# Altium project PROC154E3_SCH.PrjPcb (part 14 of 60)
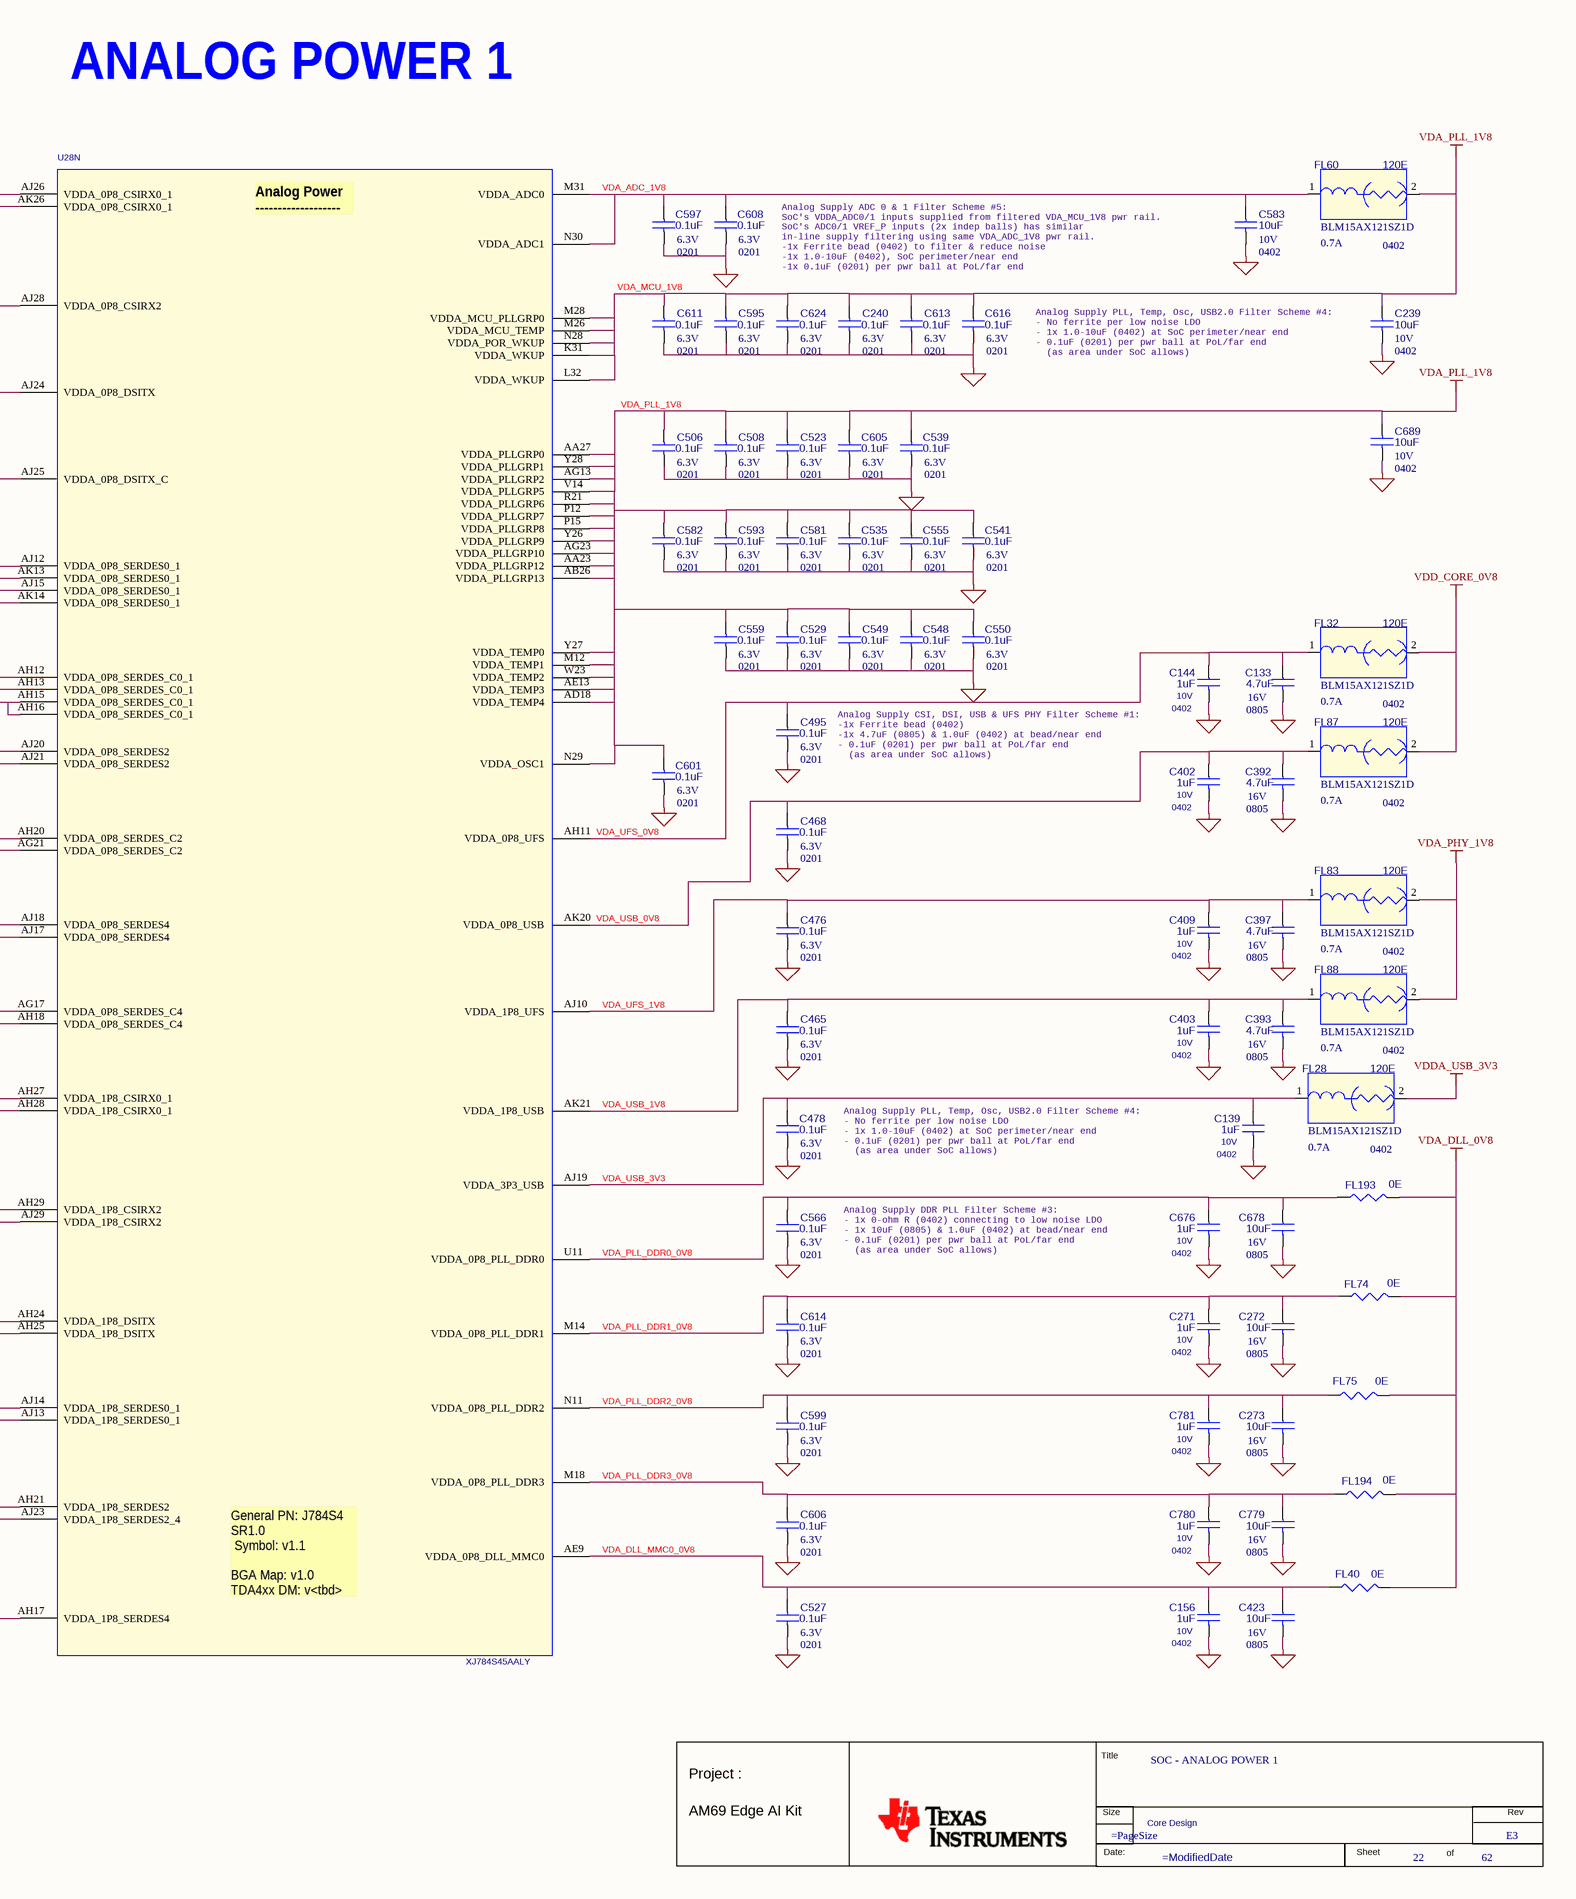
[diagram p106: 22. SOC ANALOG POWER 1.SchDoc, right]

## Sheet 22. SOC ANALOG POWER 1.SchDoc: SOC - ANALOG POWER 1 (continued)
### Library data of the parts
*#22 = MISTRAL_TITLEBLK_CSIZE_1: Issue: 1.0; Project: PROC154E2(001)_SK_AM69; Name: PROC154E2 001 SK AM69; Page Create Date: March  8, 1995; Page Size: =PageSize; Page Modify Date: =ModifiedDate; Schematic Page Count: 62; Schematic Page Number: 22
C123 = CAP_Dup1: CAP CERAMIC 4.7uF 16V 10% X7R AUTO 0805; Part Reference: C123; Part_type: CAPACITORS\CERAMIC; Mfr_part_number: GCM21BR71C475KA73K; Mfr_name: MURATA; Mistral Part No: 120018100002-R; Custom_Duty: 15%; Customs_HS_Code: 85322990; Wattage: NA; Project: TI_J7_SVB-DUT; Value: 4.7uF; PCB Footprint: CAP0805_1-5; Footprint Path: Y:\MIS_DATABASE\Library\ALTIUM_TOOL\PCB_FOOTPRINTS\Altium_Footprint_Lib.PcbLib; Library Path: Y:\MIS_DATABASE\Library\ALTIUM_TOOL\SCHEMATICS_PARTS\MS_DISCRETE_Library.schlib; MECHANICAL 3D STEP FILE: CAP0805_1-5; Chkd/date: MANIRAJA/011018; Crtd /date: MANIRAJA/011018; Datasheet: Y:\MIS_DATABASE\DATASHEETS\CAPACITORS\GCM21BR71C475KA73.PDF; Temperature: -55°C+125°C; Weight: 9.5mg; Height: 1.40MM; Library Ref: CAP; Distributor_part_number: 490-14532-1-ND; Distributor_name: DIGIKEY; Tolerance: 10%; Footprint Ref: CAP0805_1-25; Manufacturer: MURATA
C124 = CAP_Dup1: CAP CERAMIC 4.7uF 16V 10% X7R AUTO 0805; Part Reference: C124; Part_type: CAPACITORS\CERAMIC; Mfr_part_number: GCM21BR71C475KA73K; Mfr_name: MURATA; Mistral Part No: 120018100002-R; Custom_Duty: 15%; Customs_HS_Code: 85322990; Wattage: NA; Project: TI_J7_SVB-DUT; Value: 4.7uF; PCB Footprint: CAP0805_1-5; Footprint Path: Y:\MIS_DATABASE\Library\ALTIUM_TOOL\PCB_FOOTPRINTS\Altium_Footprint_Lib.PcbLib; Library Path: Y:\MIS_DATABASE\Library\ALTIUM_TOOL\SCHEMATICS_PARTS\MS_DISCRETE_Library.schlib; MECHANICAL 3D STEP FILE: CAP0805_1-5; Chkd/date: MANIRAJA/011018; Crtd /date: MANIRAJA/011018; Datasheet: Y:\MIS_DATABASE\DATASHEETS\CAPACITORS\GCM21BR71C475KA73.PDF; Temperature: -55°C+125°C; Weight: 9.5mg; Height: 1.40MM; Library Ref: CAP; Distributor_part_number: 490-14532-1-ND; Distributor_name: DIGIKEY; Tolerance: 10%; Footprint Ref: CAP0805_1-25; Manufacturer: MURATA
C125 = CAP_Dup1: CAP CERAMIC 22uF 6.3V 20% X7T AUTO 0805; Part Reference: C125; Mistral Part No: 120018100065-R; Mfr_name: MURATA; Mfr_part_number: GCM21BD70J226ME36L; Part_type: CAPACITORS\CERAMIC; Automotive Alternate_mfr_name: TDK; Automotive Alternate_mfr_part_number: CGA4J1X7T0J226M; Project: TI_J7ES_EVM_SOM; Wattage: NA; Customs_HS_Code: 85322990; Custom_Duty: 15%; Value: 22uF; PCB Footprint: CAP0805_1-25; Footprint Ref: CAP0805_1-25; Tolerance: 20%; Distributor_name: MOUSER; Distributor_part_number: 81-GCM21BD70J226ME6L; Library Ref: CAP; Height: 1.25MM; Weight: NA; Temperature: -55°C+125°C; Datasheet: Y:\MIS_DATABASE\DATASHEETS\CAPACITORS\GCM-SERIES.PDF; Crtd /date: ALVY/251018; Chkd/date: MANIRAJA/261018; MECHANICAL 3D STEP FILE: CAP0805_1-25; Library Path: Y:\MIS_DATABASE\Library\ALTIUM_TOOL\SCHEMATICS_PARTS\MS_DISCRETE_Library.schlib; Footprint Path: Y:\MIS_DATABASE\Library\ALTIUM_TOOL\PCB_FOOTPRINTS\Altium_Footprint_Lib.PcbLib; Manufacturer: MURATA
C126 = CAP_Dup1: CAP CERAMIC 22uF 6.3V 20% X7T AUTO 0805; Part Reference: C126; Part_type: CAPACITORS\CERAMIC; Mfr_part_number: GCM21BD70J226ME36L; Mfr_name: MURATA; Mistral Part No: 120018100065-R; Automotive Alternate_mfr_name: TDK; Automotive Alternate_mfr_part_number: CGA4J1X7T0J226M; Custom_Duty: 15%; Customs_HS_Code: 85322990; Wattage: NA; Project: TI_J7ES_EVM_SOM; Value: 22uF; PCB Footprint: CAP0805_1-25; Footprint Path: Y:\MIS_DATABASE\Library\ALTIUM_TOOL\PCB_FOOTPRINTS\Altium_Footprint_Lib.PcbLib; Library Path: Y:\MIS_DATABASE\Library\ALTIUM_TOOL\SCHEMATICS_PARTS\MS_DISCRETE_Library.schlib; MECHANICAL 3D STEP FILE: CAP0805_1-25; Chkd/date: MANIRAJA/261018; Crtd /date: ALVY/251018; Datasheet: Y:\MIS_DATABASE\DATASHEETS\CAPACITORS\GCM-SERIES.PDF; Temperature: -55°C+125°C; Weight: NA; Height: 1.25MM; Library Ref: CAP; Distributor_part_number: 81-GCM21BD70J226ME6L; Distributor_name: MOUSER; Tolerance: 20%; Footprint Ref: CAP0805_1-25; Manufacturer: MURATA
C127 = CAP_Dup1: CAP CERAMIC 22uF 6.3V 20% X7T AUTO 0805; Part Reference: C127; Part_type: CAPACITORS\CERAMIC; Mfr_part_number: GCM21BD70J226ME36L; Mfr_name: MURATA; Mistral Part No: 120018100065-R; Automotive Alternate_mfr_name: TDK; Automotive Alternate_mfr_part_number: CGA4J1X7T0J226M; Custom_Duty: 15%; Customs_HS_Code: 85322990; Wattage: NA; Project: TI_J7ES_EVM_SOM; Value: 22uF; PCB Footprint: CAP0805_1-25; Footprint Path: Y:\MIS_DATABASE\Library\ALTIUM_TOOL\PCB_FOOTPRINTS\Altium_Footprint_Lib.PcbLib; Library Path: Y:\MIS_DATABASE\Library\ALTIUM_TOOL\SCHEMATICS_PARTS\MS_DISCRETE_Library.schlib; MECHANICAL 3D STEP FILE: CAP0805_1-25; Chkd/date: MANIRAJA/261018; Crtd /date: ALVY/251018; Datasheet: Y:\MIS_DATABASE\DATASHEETS\CAPACITORS\GCM-SERIES.PDF; Temperature: -55°C+125°C; Weight: NA; Height: 1.25MM; Library Ref: CAP; Distributor_part_number: 81-GCM21BD70J226ME6L; Distributor_name: MOUSER; Tolerance: 20%; Footprint Ref: CAP0805_1-25; Manufacturer: MURATA
C128 = CAP_Dup1: CAP CERAMIC 22uF 6.3V 20% X7T AUTO 0805; Part Reference: C128; Automotive Alternate_mfr_part_number: CGA4J1X7T0J226M; Automotive Alternate_mfr_name: TDK; Part_type: CAPACITORS\CERAMIC; Mfr_part_number: GCM21BD70J226ME36L; Mfr_name: MURATA; Mistral Part No: 120018100065-R; Custom_Duty: 15%; Customs_HS_Code: 85322990; Wattage: NA; Project: TI_J7ES_EVM_SOM; Value: 22uF; PCB Footprint: CAP0805_1-25; Footprint Path: Y:\MIS_DATABASE\Library\ALTIUM_TOOL\PCB_FOOTPRINTS\Altium_Footprint_Lib.PcbLib; Library Path: Y:\MIS_DATABASE\Library\ALTIUM_TOOL\SCHEMATICS_PARTS\MS_DISCRETE_Library.schlib; MECHANICAL 3D STEP FILE: CAP0805_1-25; Chkd/date: MANIRAJA/261018; Crtd /date: ALVY/251018; Datasheet: Y:\MIS_DATABASE\DATASHEETS\CAPACITORS\GCM-SERIES.PDF; Temperature: -55°C+125°C; Weight: NA; Height: 1.25MM; Library Ref: CAP; Distributor_part_number: 81-GCM21BD70J226ME6L; Distributor_name: MOUSER; Tolerance: 20%; Footprint Ref: CAP0805_1-25; Manufacturer: MURATA
C129 = CAP_Dup1: CAP CERAMIC 22uF 6.3V 20% X7T AUTO 0805; Part Reference: C129; Mistral Part No: 120018100065-R; Mfr_name: MURATA; Mfr_part_number: GCM21BD70J226ME36L; Part_type: CAPACITORS\CERAMIC; Automotive Alternate_mfr_name: TDK; Automotive Alternate_mfr_part_number: CGA4J1X7T0J226M; Project: TI_J7ES_EVM_SOM; Wattage: NA; Customs_HS_Code: 85322990; Custom_Duty: 15%; Value: 22uF; PCB Footprint: CAP0805_1-25; Footprint Ref: CAP0805_1-25; Tolerance: 20%; Distributor_name: MOUSER; Distributor_part_number: 81-GCM21BD70J226ME6L; Library Ref: CAP; Height: 1.25MM; Weight: NA; Temperature: -55°C+125°C; Datasheet: Y:\MIS_DATABASE\DATASHEETS\CAPACITORS\GCM-SERIES.PDF; Crtd /date: ALVY/251018; Chkd/date: MANIRAJA/261018; MECHANICAL 3D STEP FILE: CAP0805_1-25; Library Path: Y:\MIS_DATABASE\Library\ALTIUM_TOOL\SCHEMATICS_PARTS\MS_DISCRETE_Library.schlib; Footprint Path: Y:\MIS_DATABASE\Library\ALTIUM_TOOL\PCB_FOOTPRINTS\Altium_Footprint_Lib.PcbLib; Manufacturer: MURATA
C130 = CAP_Dup1: CAP CERAMIC 22uF 6.3V 20% X7T AUTO 0805; Part Reference: C130; Part_type: CAPACITORS\CERAMIC; Mfr_part_number: GCM21BD70J226ME36L; Mfr_name: MURATA; Mistral Part No: 120018100065-R; Automotive Alternate_mfr_name: TDK; Automotive Alternate_mfr_part_number: CGA4J1X7T0J226M; Custom_Duty: 15%; Customs_HS_Code: 85322990; Wattage: NA; Project: TI_J7ES_EVM_SOM; Value: 22uF; PCB Footprint: CAP0805_1-25; Footprint Path: Y:\MIS_DATABASE\Library\ALTIUM_TOOL\PCB_FOOTPRINTS\Altium_Footprint_Lib.PcbLib; Library Path: Y:\MIS_DATABASE\Library\ALTIUM_TOOL\SCHEMATICS_PARTS\MS_DISCRETE_Library.schlib; MECHANICAL 3D STEP FILE: CAP0805_1-25; Chkd/date: MANIRAJA/261018; Crtd /date: ALVY/251018; Datasheet: Y:\MIS_DATABASE\DATASHEETS\CAPACITORS\GCM-SERIES.PDF; Temperature: -55°C+125°C; Weight: NA; Height: 1.25MM; Library Ref: CAP; Distributor_part_number: 81-GCM21BD70J226ME6L; Distributor_name: MOUSER; Tolerance: 20%; Footprint Ref: CAP0805_1-25; Manufacturer: MURATA
C133 = CAP_Dup1: CAP CERAMIC 4.7uF 16V 10% X7R AUTO 0805; Part Reference: C133; Mistral Part No: 120018100002-R; Mfr_name: MURATA; Mfr_part_number: GCM21BR71C475KA73K; Part_type: CAPACITORS\CERAMIC; Project: TI_J7_SVB-DUT; Wattage: NA; Customs_HS_Code: 85322990; Custom_Duty: 15%; Value: 4.7uF; PCB Footprint: CAP0805_1-5; Footprint Ref: CAP0805_1-25; Tolerance: 10%; Distributor_name: DIGIKEY; Distributor_part_number: 490-14532-1-ND; Library Ref: CAP; Height: 1.40MM; Weight: 9.5mg; Temperature: -55°C+125°C; Datasheet: Y:\MIS_DATABASE\DATASHEETS\CAPACITORS\GCM21BR71C475KA73.PDF; Crtd /date: MANIRAJA/011018; Chkd/date: MANIRAJA/011018; MECHANICAL 3D STEP FILE: CAP0805_1-5; Library Path: Y:\MIS_DATABASE\Library\ALTIUM_TOOL\SCHEMATICS_PARTS\MS_DISCRETE_Library.schlib; Footprint Path: Y:\MIS_DATABASE\Library\ALTIUM_TOOL\PCB_FOOTPRINTS\Altium_Footprint_Lib.PcbLib; Manufacturer: MURATA
C134 = CAP_Dup1: CAP CERAMIC 1uF 10V 10% X7S AUTO 0402; Part Reference: C134; Mistral Part No: 120018090021-R; Mfr_name: MURATA; Mfr_part_number: GCM155C71A105KE38D; Part_type: CAPACITORS\CERAMIC; Project: SMART-M_SCRIPTALK_PB; Wattage: NA; Customs_HS_Code: 85322990; Custom_Duty: 15%; Value: 1uF; PCB Footprint: CAP0402_0-75; Footprint Ref: CAP0402_0-75; Tolerance: 10%; Distributor_name: DIGIKEY; Distributor_part_number: 490-13409-1-ND; Library Ref: CAP; Height: 0.70MM; Weight: 6mg; Temperature: -55°C+125°C; Datasheet: Y:\MIS_DATABASE\DATASHEETS\CAPACITORS\MURATA-GCM-SER.PDF; Crtd /date: ALVY/100918; Chkd/date: MANIRAJA/100918; MECHANICAL 3D STEP FILE: CAP0402_0-75; Library Path: Y:\MIS_DATABASE\Library\ALTIUM_TOOL\SCHEMATICS_PARTS\MS_DISCRETE_Library.schlib; Footprint Path: Y:\MIS_DATABASE\Library\ALTIUM_TOOL\PCB_FOOTPRINTS\Altium_Footprint_Lib.PcbLib; Manufacturer: MURATA
C135 = CAP_Dup1: CAP CERAMIC 1uF 10V 10% X7S AUTO 0402; Part Reference: C135; Mistral Part No: 120018090021-R; Mfr_name: MURATA; Mfr_part_number: GCM155C71A105KE38D; Part_type: CAPACITORS\CERAMIC; Project: SMART-M_SCRIPTALK_PB; Wattage: NA; Customs_HS_Code: 85322990; Custom_Duty: 15%; Value: 1uF; PCB Footprint: CAP0402_0-75; Footprint Ref: CAP0402_0-75; Tolerance: 10%; Distributor_name: DIGIKEY; Distributor_part_number: 490-13409-1-ND; Library Ref: CAP; Height: 0.70MM; Weight: 6mg; Temperature: -55°C+125°C; Datasheet: Y:\MIS_DATABASE\DATASHEETS\CAPACITORS\MURATA-GCM-SER.PDF; Crtd /date: ALVY/100918; Chkd/date: MANIRAJA/100918; MECHANICAL 3D STEP FILE: CAP0402_0-75; Library Path: Y:\MIS_DATABASE\Library\ALTIUM_TOOL\SCHEMATICS_PARTS\MS_DISCRETE_Library.schlib; Footprint Path: Y:\MIS_DATABASE\Library\ALTIUM_TOOL\PCB_FOOTPRINTS\Altium_Footprint_Lib.PcbLib; Manufacturer: MURATA
C136 = CAP_Dup1: CAP CERAMIC 1uF 10V 10% X7S AUTO 0402; Part Reference: C136; Part_type: CAPACITORS\CERAMIC; Mfr_part_number: GCM155C71A105KE38D; Mfr_name: MURATA; Mistral Part No: 120018090021-R; Custom_Duty: 15%; Customs_HS_Code: 85322990; Wattage: NA; Project: SMART-M_SCRIPTALK_PB; Value: 1uF; PCB Footprint: CAP0402_0-75; Footprint Path: Y:\MIS_DATABASE\Library\ALTIUM_TOOL\PCB_FOOTPRINTS\Altium_Footprint_Lib.PcbLib; Library Path: Y:\MIS_DATABASE\Library\ALTIUM_TOOL\SCHEMATICS_PARTS\MS_DISCRETE_Library.schlib; MECHANICAL 3D STEP FILE: CAP0402_0-75; Chkd/date: MANIRAJA/100918; Crtd /date: ALVY/100918; Datasheet: Y:\MIS_DATABASE\DATASHEETS\CAPACITORS\MURATA-GCM-SER.PDF; Temperature: -55°C+125°C; Weight: 6mg; Height: 0.70MM; Library Ref: CAP; Distributor_part_number: 490-13409-1-ND; Distributor_name: DIGIKEY; Tolerance: 10%; Footprint Ref: CAP0402_0-75; Manufacturer: MURATA
C137 = CAP_Dup1: CAP CERAMIC 1uF 10V 10% X7S AUTO 0402; Part Reference: C137; Part_type: CAPACITORS\CERAMIC; Mfr_part_number: GCM155C71A105KE38D; Mfr_name: MURATA; Mistral Part No: 120018090021-R; Custom_Duty: 15%; Customs_HS_Code: 85322990; Wattage: NA; Project: SMART-M_SCRIPTALK_PB; Value: 1uF; PCB Footprint: CAP0402_0-75; Footprint Path: Y:\MIS_DATABASE\Library\ALTIUM_TOOL\PCB_FOOTPRINTS\Altium_Footprint_Lib.PcbLib; Library Path: Y:\MIS_DATABASE\Library\ALTIUM_TOOL\SCHEMATICS_PARTS\MS_DISCRETE_Library.schlib; MECHANICAL 3D STEP FILE: CAP0402_0-75; Chkd/date: MANIRAJA/100918; Crtd /date: ALVY/100918; Datasheet: Y:\MIS_DATABASE\DATASHEETS\CAPACITORS\MURATA-GCM-SER.PDF; Temperature: -55°C+125°C; Weight: 6mg; Height: 0.70MM; Library Ref: CAP; Distributor_part_number: 490-13409-1-ND; Distributor_name: DIGIKEY; Tolerance: 10%; Footprint Ref: CAP0402_0-75; Manufacturer: MURATA
C138 = CAP_Dup1: CAP CERAMIC 1uF 10V 10% X7S AUTO 0402; Part Reference: C138; Mistral Part No: 120018090021-R; Mfr_name: MURATA; Mfr_part_number: GCM155C71A105KE38D; Part_type: CAPACITORS\CERAMIC; Project: SMART-M_SCRIPTALK_PB; Wattage: NA; Customs_HS_Code: 85322990; Custom_Duty: 15%; Value: 1uF; PCB Footprint: CAP0402_0-75; Footprint Ref: CAP0402_0-75; Tolerance: 10%; Distributor_name: DIGIKEY; Distributor_part_number: 490-13409-1-ND; Library Ref: CAP; Height: 0.70MM; Weight: 6mg; Temperature: -55°C+125°C; Datasheet: Y:\MIS_DATABASE\DATASHEETS\CAPACITORS\MURATA-GCM-SER.PDF; Crtd /date: ALVY/100918; Chkd/date: MANIRAJA/100918; MECHANICAL 3D STEP FILE: CAP0402_0-75; Library Path: Y:\MIS_DATABASE\Library\ALTIUM_TOOL\SCHEMATICS_PARTS\MS_DISCRETE_Library.schlib; Footprint Path: Y:\MIS_DATABASE\Library\ALTIUM_TOOL\PCB_FOOTPRINTS\Altium_Footprint_Lib.PcbLib; Manufacturer: MURATA
C139 = CAP_Dup1: CAP CERAMIC 1uF 10V 10% X7S AUTO 0402; Part Reference: C139; Manufacturer: MURATA; Mistral Part No: 120018090021-R; Mfr_part_number: GCM155C71A105KE38D; Part_type: CAPACITORS\CERAMIC; Project: SMART-M_SCRIPTALK_PB; Wattage: NA; Customs_HS_Code: 85322990; Custom_Duty: 15%; Value: 1uF; Footprint Ref: CAP0402_0-75; Mfr_name: MURATA; Tolerance: 10%; Distributor_name: DIGIKEY; Distributor_part_number: 490-13409-1-ND; Library Ref: CAP; Height: 0.70MM; Weight: 6mg; Temperature: -55°C+125°C; Datasheet: Y:\MIS_DATABASE\DATASHEETS\CAPACITORS\MURATA-GCM-SER.PDF; Crtd /date: ALVY/100918; Chkd/date: MANIRAJA/100918; MECHANICAL 3D STEP FILE: CAP0402_0-75; Library Path: Y:\MIS_DATABASE\Library\ALTIUM_TOOL\SCHEMATICS_PARTS\MS_DISCRETE_Library.schlib; Footprint Path: Y:\MIS_DATABASE\Library\ALTIUM_TOOL\PCB_FOOTPRINTS\Altium_Footprint_Lib.PcbLib; PCB Footprint: CAP0402_0-75
C140 = CAP_Dup1: CAP CERAMIC 1uF 10V 10% X7S AUTO 0402; Part Reference: C140; Mistral Part No: 120018090021-R; Mfr_name: MURATA; Mfr_part_number: GCM155C71A105KE38D; Part_type: CAPACITORS\CERAMIC; Project: SMART-M_SCRIPTALK_PB; Wattage: NA; Customs_HS_Code: 85322990; Custom_Duty: 15%; Value: 1uF; PCB Footprint: CAP0402_0-75; Footprint Ref: CAP0402_0-75; Tolerance: 10%; Distributor_name: DIGIKEY; Distributor_part_number: 490-13409-1-ND; Library Ref: CAP; Height: 0.70MM; Weight: 6mg; Temperature: -55°C+125°C; Datasheet: Y:\MIS_DATABASE\DATASHEETS\CAPACITORS\MURATA-GCM-SER.PDF; Crtd /date: ALVY/100918; Chkd/date: MANIRAJA/100918; MECHANICAL 3D STEP FILE: CAP0402_0-75; Library Path: Y:\MIS_DATABASE\Library\ALTIUM_TOOL\SCHEMATICS_PARTS\MS_DISCRETE_Library.schlib; Footprint Path: Y:\MIS_DATABASE\Library\ALTIUM_TOOL\PCB_FOOTPRINTS\Altium_Footprint_Lib.PcbLib; Manufacturer: MURATA
C141 = CAP_Dup1: CAP CERAMIC 1uF 10V 10% X7S AUTO 0402; Part Reference: C141; Part_type: CAPACITORS\CERAMIC; Mfr_part_number: GCM155C71A105KE38D; Mfr_name: MURATA; Mistral Part No: 120018090021-R; Custom_Duty: 15%; Customs_HS_Code: 85322990; Wattage: NA; Project: SMART-M_SCRIPTALK_PB; Value: 1uF; PCB Footprint: CAP0402_0-75; Footprint Path: Y:\MIS_DATABASE\Library\ALTIUM_TOOL\PCB_FOOTPRINTS\Altium_Footprint_Lib.PcbLib; Library Path: Y:\MIS_DATABASE\Library\ALTIUM_TOOL\SCHEMATICS_PARTS\MS_DISCRETE_Library.schlib; MECHANICAL 3D STEP FILE: CAP0402_0-75; Chkd/date: MANIRAJA/100918; Crtd /date: ALVY/100918; Datasheet: Y:\MIS_DATABASE\DATASHEETS\CAPACITORS\MURATA-GCM-SER.PDF; Temperature: -55°C+125°C; Weight: 6mg; Height: 0.70MM; Library Ref: CAP; Distributor_part_number: 490-13409-1-ND; Distributor_name: DIGIKEY; Tolerance: 10%; Footprint Ref: CAP0402_0-75; Manufacturer: MURATA
C142 = CAP_Dup1: CAP CERAMIC 1uF 10V 10% X7S AUTO 0402; Part Reference: C142; Part_type: CAPACITORS\CERAMIC; Mfr_part_number: GCM155C71A105KE38D; Mfr_name: MURATA; Mistral Part No: 120018090021-R; Custom_Duty: 15%; Customs_HS_Code: 85322990; Wattage: NA; Project: SMART-M_SCRIPTALK_PB; Value: 1uF; PCB Footprint: CAP0402_0-75; Footprint Path: Y:\MIS_DATABASE\Library\ALTIUM_TOOL\PCB_FOOTPRINTS\Altium_Footprint_Lib.PcbLib; Library Path: Y:\MIS_DATABASE\Library\ALTIUM_TOOL\SCHEMATICS_PARTS\MS_DISCRETE_Library.schlib; MECHANICAL 3D STEP FILE: CAP0402_0-75; Chkd/date: MANIRAJA/100918; Crtd /date: ALVY/100918; Datasheet: Y:\MIS_DATABASE\DATASHEETS\CAPACITORS\MURATA-GCM-SER.PDF; Temperature: -55°C+125°C; Weight: 6mg; Height: 0.70MM; Library Ref: CAP; Distributor_part_number: 490-13409-1-ND; Distributor_name: DIGIKEY; Tolerance: 10%; Footprint Ref: CAP0402_0-75; Manufacturer: MURATA
C144 = CAP_Dup1: CAP CERAMIC 1uF 10V 10% X7S AUTO 0402; Part Reference: C144; Part_type: CAPACITORS\CERAMIC; Mfr_part_number: GCM155C71A105KE38D; Mfr_name: MURATA; Mistral Part No: 120018090021-R; Custom_Duty: 15%; Customs_HS_Code: 85322990; Wattage: NA; Project: SMART-M_SCRIPTALK_PB; Value: 1uF; PCB Footprint: CAP0402_0-75; Footprint Path: Y:\MIS_DATABASE\Library\ALTIUM_TOOL\PCB_FOOTPRINTS\Altium_Footprint_Lib.PcbLib; Library Path: Y:\MIS_DATABASE\Library\ALTIUM_TOOL\SCHEMATICS_PARTS\MS_DISCRETE_Library.schlib; MECHANICAL 3D STEP FILE: CAP0402_0-75; Chkd/date: MANIRAJA/100918; Crtd /date: ALVY/100918; Datasheet: Y:\MIS_DATABASE\DATASHEETS\CAPACITORS\MURATA-GCM-SER.PDF; Temperature: -55°C+125°C; Weight: 6mg; Height: 0.70MM; Library Ref: CAP; Distributor_part_number: 490-13409-1-ND; Distributor_name: DIGIKEY; Tolerance: 10%; Footprint Ref: CAP0402_0-75; Manufacturer: MURATA
C156 = CAP_Dup1: CAP CERAMIC 1uF 10V 10% X7S AUTO 0402; Part Reference: C156; Mistral Part No: 120018090021-R; Mfr_name: MURATA; Mfr_part_number: GCM155C71A105KE38D; Part_type: CAPACITORS\CERAMIC; Project: SMART-M_SCRIPTALK_PB; Wattage: NA; Customs_HS_Code: 85322990; Custom_Duty: 15%; Value: 1uF; PCB Footprint: CAP0402_0-75; Footprint Ref: CAP0402_0-75; Tolerance: 10%; Distributor_name: DIGIKEY; Distributor_part_number: 490-13409-1-ND; Library Ref: CAP; Height: 0.70MM; Weight: 6mg; Temperature: -55°C+125°C; Datasheet: Y:\MIS_DATABASE\DATASHEETS\CAPACITORS\MURATA-GCM-SER.PDF; Crtd /date: ALVY/100918; Chkd/date: MANIRAJA/100918; MECHANICAL 3D STEP FILE: CAP0402_0-75; Library Path: Y:\MIS_DATABASE\Library\ALTIUM_TOOL\SCHEMATICS_PARTS\MS_DISCRETE_Library.schlib; Footprint Path: Y:\MIS_DATABASE\Library\ALTIUM_TOOL\PCB_FOOTPRINTS\Altium_Footprint_Lib.PcbLib; Manufacturer: MURATA
C239 = CAP_Dup1: CAP CERAMIC 10uF 10V 20% X5R 0402; Part Reference: C239; Part_type: CAPACITORS\CERAMIC; Mfr_part_number: GRM155R61A106ME11D; Mfr_name: MURATA; Mistral Part No: 120013110019-R; Custom_Duty: 15%; Customs_HS_Code: 85322990; Wattage: NA; Project: QCS610_NANOSOM; Value: 10uF; PCB Footprint: CAP0402_0-75; Footprint Path: Y:\MIS_DATABASE\Library\ALTIUM_TOOL\PCB_FOOTPRINTS\Altium_Footprint_Lib.PcbLib; Library Path: Y:\MIS_DATABASE\Library\ALTIUM_TOOL\SCHEMATICS_PARTS\MS_DISCRETE_Library.schlib; MECHANICAL 3D STEP FILE: CAP0402_0-75; Chkd/date: MANIRAJA/300520; Crtd /date: ALVY/260520; Datasheet: Y:\MIS_DATABASE\DATASHEETS\CAPACITORS\MURATA-GXX-SER_NOV17.PDF; Temperature: -55°C+85°C; Weight: 3.1mg; Height: 0.55MM; Library Ref: CAP; Distributor_part_number: 490-GRM155R61A106ME11DTR-ND; Distributor_name: DIGIKEY; Tolerance: 20%; Footprint Ref: CAP0402_0-75; Manufacturer: MURATA
C240 = CAP_Dup1: CAP CERAMIC 0.1uF 6.3V 10% X7S AUTO 0201; Part Reference: C240; Mistral Part No: 120018100001-R; Mfr_name: MURATA; Mfr_part_number: GCM033C70J104KE02D; Part_type: CAPACITORS\CERAMIC; Project: TI_J7_SVB-DUT; Wattage: NA; Customs_HS_Code: 85322990; Custom_Duty: 15%; Value: 0.1uF; PCB Footprint: CAP0201_0-5; Footprint Ref: CAP0201_0-5; Tolerance: 10%; Distributor_name: NA; Distributor_part_number: NA; Library Ref: CAP; Height: 0.33MM; Weight: NA; Temperature: -55°C+125°C; Datasheet: Y:\MIS_DATABASE\DATASHEETS\CAPACITORS\MURATA-GCM-SER.PDF; Crtd /date: MANIRAJA/011018; Chkd/date: MANIRAJA/011018; MECHANICAL 3D STEP FILE: CAP0201_0-5; Library Path: Y:\MIS_DATABASE\Library\ALTIUM_TOOL\SCHEMATICS_PARTS\MS_DISCRETE_Library.schlib; Footprint Path: Y:\MIS_DATABASE\Library\ALTIUM_TOOL\PCB_FOOTPRINTS\Altium_Footprint_Lib.PcbLib; Manufacturer: MURATA
C271 = CAP_Dup1: CAP CERAMIC 1uF 10V 10% X7S AUTO 0402; Part Reference: C271; Mistral Part No: 120018090021-R; Mfr_name: MURATA; Mfr_part_number: GCM155C71A105KE38D; Part_type: CAPACITORS\CERAMIC; Project: SMART-M_SCRIPTALK_PB; Wattage: NA; Customs_HS_Code: 85322990; Custom_Duty: 15%; Value: 1uF; PCB Footprint: CAP0402_0-75; Footprint Ref: CAP0402_0-75; Tolerance: 10%; Distributor_name: DIGIKEY; Distributor_part_number: 490-13409-1-ND; Library Ref: CAP; Height: 0.70MM; Weight: 6mg; Temperature: -55°C+125°C; Datasheet: Y:\MIS_DATABASE\DATASHEETS\CAPACITORS\MURATA-GCM-SER.PDF; Crtd /date: ALVY/100918; Chkd/date: MANIRAJA/100918; MECHANICAL 3D STEP FILE: CAP0402_0-75; Library Path: Y:\MIS_DATABASE\Library\ALTIUM_TOOL\SCHEMATICS_PARTS\MS_DISCRETE_Library.schlib; Footprint Path: Y:\MIS_DATABASE\Library\ALTIUM_TOOL\PCB_FOOTPRINTS\Altium_Footprint_Lib.PcbLib; Manufacturer: MURATA
C272 = CAP_Dup1: CAP CERAMIC 10uF 16V 10% X5R 0805; Part Reference: C272; Direct Alternate_mfr_part_number: C2012X7S1C106K125AC; Direct Alternate_mfr_name: TDK; Automotive Alternate_mfr_part_number: CGA4J1X7S1C106K125AC; Mistral Part No: 120009030205-R; Mfr_name: MURATA; Mfr_part_number: GRM21BR61C106KE15L; Part_type: CAPACITORS\CERAMIC; Project: VOCERA; Wattage: NA; Customs_HS_Code: 85322990; Custom_Duty: 15%; Value: 10uF; PCB Footprint: CAP0805_1-5; Automotive Alternate_mfr_name: TDK; Footprint Ref: CAP0805_1-25; Tolerance: 10%; Distributor_name: DIGIKEY; Distributor_part_number: 490-3886-1-ND; Library Ref: CAP; Height: 1.35MM; Weight: 9.5mg; Temperature: -55°C+85°C; Datasheet: Y:\MIS_DATABASE\DATASHEETS\CAPACITORS\MURATA-GXX-SER_NOV17.PDF; Crtd /date: MAZHAR/150506; Chkd/date: SHREESHAIL/220506; MECHANICAL 3D STEP FILE: CAP0805_1-5; Library Path: Y:\MIS_DATABASE\Library\ALTIUM_TOOL\SCHEMATICS_PARTS\MS_DISCRETE_Library.schlib; Footprint Path: Y:\MIS_DATABASE\Library\ALTIUM_TOOL\PCB_FOOTPRINTS\Altium_Footprint_Lib.PcbLib; Manufacturer: MURATA
C273 = CAP_Dup1: CAP CERAMIC 10uF 16V 10% X5R 0805; Part Reference: C273; Direct Alternate_mfr_part_number: C2012X7S1C106K125AC; Direct Alternate_mfr_name: TDK; Automotive Alternate_mfr_part_number: CGA4J1X7S1C106K125AC; Mistral Part No: 120009030205-R; Mfr_name: MURATA; Mfr_part_number: GRM21BR61C106KE15L; Part_type: CAPACITORS\CERAMIC; Project: VOCERA; Wattage: NA; Customs_HS_Code: 85322990; Custom_Duty: 15%; Value: 10uF; PCB Footprint: CAP0805_1-5; Automotive Alternate_mfr_name: TDK; Footprint Ref: CAP0805_1-25; Tolerance: 10%; Distributor_name: DIGIKEY; Distributor_part_number: 490-3886-1-ND; Library Ref: CAP; Height: 1.35MM; Weight: 9.5mg; Temperature: -55°C+85°C; Datasheet: Y:\MIS_DATABASE\DATASHEETS\CAPACITORS\MURATA-GXX-SER_NOV17.PDF; Crtd /date: MAZHAR/150506; Chkd/date: SHREESHAIL/220506; MECHANICAL 3D STEP FILE: CAP0805_1-5; Library Path: Y:\MIS_DATABASE\Library\ALTIUM_TOOL\SCHEMATICS_PARTS\MS_DISCRETE_Library.schlib; Footprint Path: Y:\MIS_DATABASE\Library\ALTIUM_TOOL\PCB_FOOTPRINTS\Altium_Footprint_Lib.PcbLib; Manufacturer: MURATA
C389 = CAP_Dup1: CAP CERAMIC 22uF 6.3V 20% X7T AUTO 0805; Part Reference: C389; Automotive Alternate_mfr_part_number: CGA4J1X7T0J226M; Automotive Alternate_mfr_name: TDK; Part_type: CAPACITORS\CERAMIC; Mfr_part_number: GCM21BD70J226ME36L; Mfr_name: MURATA; Mistral Part No: 120018100065-R; Custom_Duty: 15%; Customs_HS_Code: 85322990; Wattage: NA; Project: TI_J7ES_EVM_SOM; Value: 22uF; PCB Footprint: CAP0805_1-25; Footprint Path: Y:\MIS_DATABASE\Library\ALTIUM_TOOL\PCB_FOOTPRINTS\Altium_Footprint_Lib.PcbLib; Library Path: Y:\MIS_DATABASE\Library\ALTIUM_TOOL\SCHEMATICS_PARTS\MS_DISCRETE_Library.schlib; MECHANICAL 3D STEP FILE: CAP0805_1-25; Chkd/date: MANIRAJA/261018; Crtd /date: ALVY/251018; Datasheet: Y:\MIS_DATABASE\DATASHEETS\CAPACITORS\GCM-SERIES.PDF; Temperature: -55°C+125°C; Weight: NA; Height: 1.25MM; Library Ref: CAP; Distributor_part_number: 81-GCM21BD70J226ME6L; Distributor_name: MOUSER; Tolerance: 20%; Footprint Ref: CAP0805_1-25; Manufacturer: MURATA
C390 = CAP_Dup1: CAP CERAMIC 22uF 6.3V 20% X7T AUTO 0805; Part Reference: C390; Automotive Alternate_mfr_part_number: CGA4J1X7T0J226M; Automotive Alternate_mfr_name: TDK; Mistral Part No: 120018100065-R; Mfr_name: MURATA; Mfr_part_number: GCM21BD70J226ME36L; Part_type: CAPACITORS\CERAMIC; Project: TI_J7ES_EVM_SOM; Wattage: NA; Customs_HS_Code: 85322990; Custom_Duty: 15%; Value: 22uF; PCB Footprint: CAP0805_1-25; Footprint Ref: CAP0805_1-25; Tolerance: 20%; Distributor_name: MOUSER; Distributor_part_number: 81-GCM21BD70J226ME6L; Library Ref: CAP; Height: 1.25MM; Weight: NA; Temperature: -55°C+125°C; Datasheet: Y:\MIS_DATABASE\DATASHEETS\CAPACITORS\GCM-SERIES.PDF; Crtd /date: ALVY/251018; Chkd/date: MANIRAJA/261018; MECHANICAL 3D STEP FILE: CAP0805_1-25; Library Path: Y:\MIS_DATABASE\Library\ALTIUM_TOOL\SCHEMATICS_PARTS\MS_DISCRETE_Library.schlib; Footprint Path: Y:\MIS_DATABASE\Library\ALTIUM_TOOL\PCB_FOOTPRINTS\Altium_Footprint_Lib.PcbLib; Manufacturer: MURATA
C391 = CAP_Dup1: CAP CERAMIC 22uF 6.3V 20% X7T AUTO 0805; Part Reference: C391; Part_type: CAPACITORS\CERAMIC; Mfr_part_number: GCM21BD70J226ME36L; Mfr_name: MURATA; Mistral Part No: 120018100065-R; Automotive Alternate_mfr_name: TDK; Automotive Alternate_mfr_part_number: CGA4J1X7T0J226M; Custom_Duty: 15%; Customs_HS_Code: 85322990; Wattage: NA; Project: TI_J7ES_EVM_SOM; Value: 22uF; PCB Footprint: CAP0805_1-25; Footprint Path: Y:\MIS_DATABASE\Library\ALTIUM_TOOL\PCB_FOOTPRINTS\Altium_Footprint_Lib.PcbLib; Library Path: Y:\MIS_DATABASE\Library\ALTIUM_TOOL\SCHEMATICS_PARTS\MS_DISCRETE_Library.schlib; MECHANICAL 3D STEP FILE: CAP0805_1-25; Chkd/date: MANIRAJA/261018; Crtd /date: ALVY/251018; Datasheet: Y:\MIS_DATABASE\DATASHEETS\CAPACITORS\GCM-SERIES.PDF; Temperature: -55°C+125°C; Weight: NA; Height: 1.25MM; Library Ref: CAP; Distributor_part_number: 81-GCM21BD70J226ME6L; Distributor_name: MOUSER; Tolerance: 20%; Footprint Ref: CAP0805_1-25; Manufacturer: MURATA
C392 = CAP_Dup1: CAP CERAMIC 4.7uF 16V 10% X7R AUTO 0805; Part Reference: C392; Mistral Part No: 120018100002-R; Mfr_name: MURATA; Mfr_part_number: GCM21BR71C475KA73K; Part_type: CAPACITORS\CERAMIC; Project: TI_J7_SVB-DUT; Wattage: NA; Customs_HS_Code: 85322990; Custom_Duty: 15%; Value: 4.7uF; PCB Footprint: CAP0805_1-5; Footprint Ref: CAP0805_1-25; Tolerance: 10%; Distributor_name: DIGIKEY; Distributor_part_number: 490-14532-1-ND; Library Ref: CAP; Height: 1.40MM; Weight: 9.5mg; Temperature: -55°C+125°C; Datasheet: Y:\MIS_DATABASE\DATASHEETS\CAPACITORS\GCM21BR71C475KA73.PDF; Crtd /date: MANIRAJA/011018; Chkd/date: MANIRAJA/011018; MECHANICAL 3D STEP FILE: CAP0805_1-5; Library Path: Y:\MIS_DATABASE\Library\ALTIUM_TOOL\SCHEMATICS_PARTS\MS_DISCRETE_Library.schlib; Footprint Path: Y:\MIS_DATABASE\Library\ALTIUM_TOOL\PCB_FOOTPRINTS\Altium_Footprint_Lib.PcbLib; Manufacturer: MURATA
C393 = CAP_Dup1: CAP CERAMIC 4.7uF 16V 10% X7R AUTO 0805; Part Reference: C393; Mistral Part No: 120018100002-R; Mfr_name: MURATA; Mfr_part_number: GCM21BR71C475KA73K; Part_type: CAPACITORS\CERAMIC; Project: TI_J7_SVB-DUT; Wattage: NA; Customs_HS_Code: 85322990; Custom_Duty: 15%; Value: 4.7uF; PCB Footprint: CAP0805_1-5; Footprint Ref: CAP0805_1-25; Tolerance: 10%; Distributor_name: DIGIKEY; Distributor_part_number: 490-14532-1-ND; Library Ref: CAP; Height: 1.40MM; Weight: 9.5mg; Temperature: -55°C+125°C; Datasheet: Y:\MIS_DATABASE\DATASHEETS\CAPACITORS\GCM21BR71C475KA73.PDF; Crtd /date: MANIRAJA/011018; Chkd/date: MANIRAJA/011018; MECHANICAL 3D STEP FILE: CAP0805_1-5; Library Path: Y:\MIS_DATABASE\Library\ALTIUM_TOOL\SCHEMATICS_PARTS\MS_DISCRETE_Library.schlib; Footprint Path: Y:\MIS_DATABASE\Library\ALTIUM_TOOL\PCB_FOOTPRINTS\Altium_Footprint_Lib.PcbLib; Manufacturer: MURATA
C394 = CAP_Dup1: CAP CERAMIC 4.7uF 16V 10% X7R AUTO 0805; Part Reference: C394; Manufacturer: MURATA; Part_type: CAPACITORS\CERAMIC; Mfr_part_number: GCM21BR71C475KA73K; Mistral Part No: 120018100002-R; Custom_Duty: 15%; Customs_HS_Code: 85322990; Wattage: NA; Project: TI_J7_SVB-DUT; Value: 4.7uF; PCB Footprint: CAP0805_1-5; Footprint Path: Y:\MIS_DATABASE\Library\ALTIUM_TOOL\PCB_FOOTPRINTS\Altium_Footprint_Lib.PcbLib; Library Path: Y:\MIS_DATABASE\Library\ALTIUM_TOOL\SCHEMATICS_PARTS\MS_DISCRETE_Library.schlib; MECHANICAL 3D STEP FILE: CAP0805_1-5; Chkd/date: MANIRAJA/011018; Crtd /date: MANIRAJA/011018; Datasheet: Y:\MIS_DATABASE\DATASHEETS\CAPACITORS\GCM21BR71C475KA73.PDF; Temperature: -55°C+125°C; Weight: 9.5mg; Height: 1.40MM; Library Ref: CAP; Distributor_part_number: 490-14532-1-ND; Distributor_name: DIGIKEY; Tolerance: 10%; Mfr_name: MURATA; Footprint Ref: CAP0805_1-25
C395 = CAP_Dup1: CAP CERAMIC 4.7uF 16V 10% X7R AUTO 0805; Part Reference: C395; Mistral Part No: 120018100002-R; Mfr_name: MURATA; Mfr_part_number: GCM21BR71C475KA73K; Part_type: CAPACITORS\CERAMIC; Project: TI_J7_SVB-DUT; Wattage: NA; Customs_HS_Code: 85322990; Custom_Duty: 15%; Value: 4.7uF; PCB Footprint: CAP0805_1-5; Footprint Ref: CAP0805_1-25; Tolerance: 10%; Distributor_name: DIGIKEY; Distributor_part_number: 490-14532-1-ND; Library Ref: CAP; Height: 1.40MM; Weight: 9.5mg; Temperature: -55°C+125°C; Datasheet: Y:\MIS_DATABASE\DATASHEETS\CAPACITORS\GCM21BR71C475KA73.PDF; Crtd /date: MANIRAJA/011018; Chkd/date: MANIRAJA/011018; MECHANICAL 3D STEP FILE: CAP0805_1-5; Library Path: Y:\MIS_DATABASE\Library\ALTIUM_TOOL\SCHEMATICS_PARTS\MS_DISCRETE_Library.schlib; Footprint Path: Y:\MIS_DATABASE\Library\ALTIUM_TOOL\PCB_FOOTPRINTS\Altium_Footprint_Lib.PcbLib; Manufacturer: MURATA
C396 = CAP_Dup1: CAP CERAMIC 4.7uF 16V 10% X7R AUTO 0805; Part Reference: C396; Mistral Part No: 120018100002-R; Mfr_name: MURATA; Mfr_part_number: GCM21BR71C475KA73K; Part_type: CAPACITORS\CERAMIC; Project: TI_J7_SVB-DUT; Wattage: NA; Customs_HS_Code: 85322990; Custom_Duty: 15%; Value: 4.7uF; PCB Footprint: CAP0805_1-5; Footprint Ref: CAP0805_1-25; Tolerance: 10%; Distributor_name: DIGIKEY; Distributor_part_number: 490-14532-1-ND; Library Ref: CAP; Height: 1.40MM; Weight: 9.5mg; Temperature: -55°C+125°C; Datasheet: Y:\MIS_DATABASE\DATASHEETS\CAPACITORS\GCM21BR71C475KA73.PDF; Crtd /date: MANIRAJA/011018; Chkd/date: MANIRAJA/011018; MECHANICAL 3D STEP FILE: CAP0805_1-5; Library Path: Y:\MIS_DATABASE\Library\ALTIUM_TOOL\SCHEMATICS_PARTS\MS_DISCRETE_Library.schlib; Footprint Path: Y:\MIS_DATABASE\Library\ALTIUM_TOOL\PCB_FOOTPRINTS\Altium_Footprint_Lib.PcbLib; Manufacturer: MURATA
C397 = CAP_Dup1: CAP CERAMIC 4.7uF 16V 10% X7R AUTO 0805; Part Reference: C397; Mistral Part No: 120018100002-R; Mfr_name: MURATA; Mfr_part_number: GCM21BR71C475KA73K; Part_type: CAPACITORS\CERAMIC; Project: TI_J7_SVB-DUT; Wattage: NA; Customs_HS_Code: 85322990; Custom_Duty: 15%; Value: 4.7uF; PCB Footprint: CAP0805_1-5; Footprint Ref: CAP0805_1-25; Tolerance: 10%; Distributor_name: DIGIKEY; Distributor_part_number: 490-14532-1-ND; Library Ref: CAP; Height: 1.40MM; Weight: 9.5mg; Temperature: -55°C+125°C; Datasheet: Y:\MIS_DATABASE\DATASHEETS\CAPACITORS\GCM21BR71C475KA73.PDF; Crtd /date: MANIRAJA/011018; Chkd/date: MANIRAJA/011018; MECHANICAL 3D STEP FILE: CAP0805_1-5; Library Path: Y:\MIS_DATABASE\Library\ALTIUM_TOOL\SCHEMATICS_PARTS\MS_DISCRETE_Library.schlib; Footprint Path: Y:\MIS_DATABASE\Library\ALTIUM_TOOL\PCB_FOOTPRINTS\Altium_Footprint_Lib.PcbLib; Manufacturer: MURATA
C399 = CAP_Dup1: CAP CERAMIC 1uF 10V 10% X7S AUTO 0402; Part Reference: C399; Mistral Part No: 120018090021-R; Mfr_name: MURATA; Mfr_part_number: GCM155C71A105KE38D; Part_type: CAPACITORS\CERAMIC; Project: SMART-M_SCRIPTALK_PB; Wattage: NA; Customs_HS_Code: 85322990; Custom_Duty: 15%; Value: 1uF; PCB Footprint: CAP0402_0-75; Footprint Ref: CAP0402_0-75; Tolerance: 10%; Distributor_name: DIGIKEY; Distributor_part_number: 490-13409-1-ND; Library Ref: CAP; Height: 0.70MM; Weight: 6mg; Temperature: -55°C+125°C; Datasheet: Y:\MIS_DATABASE\DATASHEETS\CAPACITORS\MURATA-GCM-SER.PDF; Crtd /date: ALVY/100918; Chkd/date: MANIRAJA/100918; MECHANICAL 3D STEP FILE: CAP0402_0-75; Library Path: Y:\MIS_DATABASE\Library\ALTIUM_TOOL\SCHEMATICS_PARTS\MS_DISCRETE_Library.schlib; Footprint Path: Y:\MIS_DATABASE\Library\ALTIUM_TOOL\PCB_FOOTPRINTS\Altium_Footprint_Lib.PcbLib; Manufacturer: MURATA
C400 = CAP_Dup1: CAP CERAMIC 1uF 10V 10% X7S AUTO 0402; Part Reference: C400; Part_type: CAPACITORS\CERAMIC; Mfr_part_number: GCM155C71A105KE38D; Mfr_name: MURATA; Mistral Part No: 120018090021-R; Custom_Duty: 15%; Customs_HS_Code: 85322990; Wattage: NA; Project: SMART-M_SCRIPTALK_PB; Value: 1uF; PCB Footprint: CAP0402_0-75; Footprint Path: Y:\MIS_DATABASE\Library\ALTIUM_TOOL\PCB_FOOTPRINTS\Altium_Footprint_Lib.PcbLib; Library Path: Y:\MIS_DATABASE\Library\ALTIUM_TOOL\SCHEMATICS_PARTS\MS_DISCRETE_Library.schlib; MECHANICAL 3D STEP FILE: CAP0402_0-75; Chkd/date: MANIRAJA/100918; Crtd /date: ALVY/100918; Datasheet: Y:\MIS_DATABASE\DATASHEETS\CAPACITORS\MURATA-GCM-SER.PDF; Temperature: -55°C+125°C; Weight: 6mg; Height: 0.70MM; Library Ref: CAP; Distributor_part_number: 490-13409-1-ND; Distributor_name: DIGIKEY; Tolerance: 10%; Footprint Ref: CAP0402_0-75; Manufacturer: MURATA
C401 = CAP_Dup1: CAP CERAMIC 1uF 10V 10% X7S AUTO 0402; Part Reference: C401; Mistral Part No: 120018090021-R; Mfr_name: MURATA; Mfr_part_number: GCM155C71A105KE38D; Part_type: CAPACITORS\CERAMIC; Project: SMART-M_SCRIPTALK_PB; Wattage: NA; Customs_HS_Code: 85322990; Custom_Duty: 15%; Value: 1uF; PCB Footprint: CAP0402_0-75; Footprint Ref: CAP0402_0-75; Tolerance: 10%; Distributor_name: DIGIKEY; Distributor_part_number: 490-13409-1-ND; Library Ref: CAP; Height: 0.70MM; Weight: 6mg; Temperature: -55°C+125°C; Datasheet: Y:\MIS_DATABASE\DATASHEETS\CAPACITORS\MURATA-GCM-SER.PDF; Crtd /date: ALVY/100918; Chkd/date: MANIRAJA/100918; MECHANICAL 3D STEP FILE: CAP0402_0-75; Library Path: Y:\MIS_DATABASE\Library\ALTIUM_TOOL\SCHEMATICS_PARTS\MS_DISCRETE_Library.schlib; Footprint Path: Y:\MIS_DATABASE\Library\ALTIUM_TOOL\PCB_FOOTPRINTS\Altium_Footprint_Lib.PcbLib; Manufacturer: MURATA
C402 = CAP_Dup1: CAP CERAMIC 1uF 10V 10% X7S AUTO 0402; Part Reference: C402; Part_type: CAPACITORS\CERAMIC; Mfr_part_number: GCM155C71A105KE38D; Mfr_name: MURATA; Mistral Part No: 120018090021-R; Custom_Duty: 15%; Customs_HS_Code: 85322990; Wattage: NA; Project: SMART-M_SCRIPTALK_PB; Value: 1uF; PCB Footprint: CAP0402_0-75; Footprint Path: Y:\MIS_DATABASE\Library\ALTIUM_TOOL\PCB_FOOTPRINTS\Altium_Footprint_Lib.PcbLib; Library Path: Y:\MIS_DATABASE\Library\ALTIUM_TOOL\SCHEMATICS_PARTS\MS_DISCRETE_Library.schlib; MECHANICAL 3D STEP FILE: CAP0402_0-75; Chkd/date: MANIRAJA/100918; Crtd /date: ALVY/100918; Datasheet: Y:\MIS_DATABASE\DATASHEETS\CAPACITORS\MURATA-GCM-SER.PDF; Temperature: -55°C+125°C; Weight: 6mg; Height: 0.70MM; Library Ref: CAP; Distributor_part_number: 490-13409-1-ND; Distributor_name: DIGIKEY; Tolerance: 10%; Footprint Ref: CAP0402_0-75; Manufacturer: MURATA
C403 = CAP_Dup1: CAP CERAMIC 1uF 10V 10% X7S AUTO 0402; Part Reference: C403; Part_type: CAPACITORS\CERAMIC; Mfr_part_number: GCM155C71A105KE38D; Mfr_name: MURATA; Mistral Part No: 120018090021-R; Custom_Duty: 15%; Customs_HS_Code: 85322990; Wattage: NA; Project: SMART-M_SCRIPTALK_PB; Value: 1uF; PCB Footprint: CAP0402_0-75; Footprint Path: Y:\MIS_DATABASE\Library\ALTIUM_TOOL\PCB_FOOTPRINTS\Altium_Footprint_Lib.PcbLib; Library Path: Y:\MIS_DATABASE\Library\ALTIUM_TOOL\SCHEMATICS_PARTS\MS_DISCRETE_Library.schlib; MECHANICAL 3D STEP FILE: CAP0402_0-75; Chkd/date: MANIRAJA/100918; Crtd /date: ALVY/100918; Datasheet: Y:\MIS_DATABASE\DATASHEETS\CAPACITORS\MURATA-GCM-SER.PDF; Temperature: -55°C+125°C; Weight: 6mg; Height: 0.70MM; Library Ref: CAP; Distributor_part_number: 490-13409-1-ND; Distributor_name: DIGIKEY; Tolerance: 10%; Footprint Ref: CAP0402_0-75; Manufacturer: MURATA
C404 = CAP_Dup1: CAP CERAMIC 1uF 10V 10% X7S AUTO 0402; Part Reference: C404; Manufacturer: MURATA; Part_type: CAPACITORS\CERAMIC; Mfr_part_number: GCM155C71A105KE38D; Mistral Part No: 120018090021-R; Custom_Duty: 15%; Customs_HS_Code: 85322990; Wattage: NA; Project: SMART-M_SCRIPTALK_PB; Value: 1uF; PCB Footprint: CAP0402_0-75; Footprint Path: Y:\MIS_DATABASE\Library\ALTIUM_TOOL\PCB_FOOTPRINTS\Altium_Footprint_Lib.PcbLib; Library Path: Y:\MIS_DATABASE\Library\ALTIUM_TOOL\SCHEMATICS_PARTS\MS_DISCRETE_Library.schlib; MECHANICAL 3D STEP FILE: CAP0402_0-75; Chkd/date: MANIRAJA/100918; Crtd /date: ALVY/100918; Datasheet: Y:\MIS_DATABASE\DATASHEETS\CAPACITORS\MURATA-GCM-SER.PDF; Temperature: -55°C+125°C; Weight: 6mg; Height: 0.70MM; Library Ref: CAP; Distributor_part_number: 490-13409-1-ND; Distributor_name: DIGIKEY; Tolerance: 10%; Mfr_name: MURATA; Footprint Ref: CAP0402_0-75
C405 = CAP_Dup1: CAP CERAMIC 1uF 10V 10% X7S AUTO 0402; Part Reference: C405; Part_type: CAPACITORS\CERAMIC; Mfr_part_number: GCM155C71A105KE38D; Mfr_name: MURATA; Mistral Part No: 120018090021-R; Custom_Duty: 15%; Customs_HS_Code: 85322990; Wattage: NA; Project: SMART-M_SCRIPTALK_PB; Value: 1uF; PCB Footprint: CAP0402_0-75; Footprint Path: Y:\MIS_DATABASE\Library\ALTIUM_TOOL\PCB_FOOTPRINTS\Altium_Footprint_Lib.PcbLib; Library Path: Y:\MIS_DATABASE\Library\ALTIUM_TOOL\SCHEMATICS_PARTS\MS_DISCRETE_Library.schlib; MECHANICAL 3D STEP FILE: CAP0402_0-75; Chkd/date: MANIRAJA/100918; Crtd /date: ALVY/100918; Datasheet: Y:\MIS_DATABASE\DATASHEETS\CAPACITORS\MURATA-GCM-SER.PDF; Temperature: -55°C+125°C; Weight: 6mg; Height: 0.70MM; Library Ref: CAP; Distributor_part_number: 490-13409-1-ND; Distributor_name: DIGIKEY; Tolerance: 10%; Footprint Ref: CAP0402_0-75; Manufacturer: MURATA
C406 = CAP_Dup1: CAP CERAMIC 1uF 10V 10% X7S AUTO 0402; Part Reference: C406; Part_type: CAPACITORS\CERAMIC; Mfr_part_number: GCM155C71A105KE38D; Mfr_name: MURATA; Mistral Part No: 120018090021-R; Custom_Duty: 15%; Customs_HS_Code: 85322990; Wattage: NA; Project: SMART-M_SCRIPTALK_PB; Value: 1uF; PCB Footprint: CAP0402_0-75; Footprint Path: Y:\MIS_DATABASE\Library\ALTIUM_TOOL\PCB_FOOTPRINTS\Altium_Footprint_Lib.PcbLib; Library Path: Y:\MIS_DATABASE\Library\ALTIUM_TOOL\SCHEMATICS_PARTS\MS_DISCRETE_Library.schlib; MECHANICAL 3D STEP FILE: CAP0402_0-75; Chkd/date: MANIRAJA/100918; Crtd /date: ALVY/100918; Datasheet: Y:\MIS_DATABASE\DATASHEETS\CAPACITORS\MURATA-GCM-SER.PDF; Temperature: -55°C+125°C; Weight: 6mg; Height: 0.70MM; Library Ref: CAP; Distributor_part_number: 490-13409-1-ND; Distributor_name: DIGIKEY; Tolerance: 10%; Footprint Ref: CAP0402_0-75; Manufacturer: MURATA
C409 = CAP_Dup1: CAP CERAMIC 1uF 10V 10% X7S AUTO 0402; Part Reference: C409; Part_type: CAPACITORS\CERAMIC; Mfr_part_number: GCM155C71A105KE38D; Mfr_name: MURATA; Mistral Part No: 120018090021-R; Custom_Duty: 15%; Customs_HS_Code: 85322990; Wattage: NA; Project: SMART-M_SCRIPTALK_PB; Value: 1uF; PCB Footprint: CAP0402_0-75; Footprint Path: Y:\MIS_DATABASE\Library\ALTIUM_TOOL\PCB_FOOTPRINTS\Altium_Footprint_Lib.PcbLib; Library Path: Y:\MIS_DATABASE\Library\ALTIUM_TOOL\SCHEMATICS_PARTS\MS_DISCRETE_Library.schlib; MECHANICAL 3D STEP FILE: CAP0402_0-75; Chkd/date: MANIRAJA/100918; Crtd /date: ALVY/100918; Datasheet: Y:\MIS_DATABASE\DATASHEETS\CAPACITORS\MURATA-GCM-SER.PDF; Temperature: -55°C+125°C; Weight: 6mg; Height: 0.70MM; Library Ref: CAP; Distributor_part_number: 490-13409-1-ND; Distributor_name: DIGIKEY; Tolerance: 10%; Footprint Ref: CAP0402_0-75; Manufacturer: MURATA
C423 = CAP_Dup1: CAP CERAMIC 10uF 16V 10% X5R 0805; Part Reference: C423; Direct Alternate_mfr_part_number: C2012X7S1C106K125AC; Direct Alternate_mfr_name: TDK; Automotive Alternate_mfr_part_number: CGA4J1X7S1C106K125AC; Mistral Part No: 120009030205-R; Mfr_name: MURATA; Mfr_part_number: GRM21BR61C106KE15L; Part_type: CAPACITORS\CERAMIC; Project: VOCERA; Wattage: NA; Customs_HS_Code: 85322990; Custom_Duty: 15%; Value: 10uF; PCB Footprint: CAP0805_1-5; Automotive Alternate_mfr_name: TDK; Footprint Ref: CAP0805_1-25; Tolerance: 10%; Distributor_name: DIGIKEY; Distributor_part_number: 490-3886-1-ND; Library Ref: CAP; Height: 1.35MM; Weight: 9.5mg; Temperature: -55°C+85°C; Datasheet: Y:\MIS_DATABASE\DATASHEETS\CAPACITORS\MURATA-GXX-SER_NOV17.PDF; Crtd /date: MAZHAR/150506; Chkd/date: SHREESHAIL/220506; MECHANICAL 3D STEP FILE: CAP0805_1-5; Library Path: Y:\MIS_DATABASE\Library\ALTIUM_TOOL\SCHEMATICS_PARTS\MS_DISCRETE_Library.schlib; Footprint Path: Y:\MIS_DATABASE\Library\ALTIUM_TOOL\PCB_FOOTPRINTS\Altium_Footprint_Lib.PcbLib; Manufacturer: MURATA
C464 = CAP_Dup1: CAP CERAMIC 0.1uF 6.3V 10% X7S AUTO 0201; Part Reference: C464; Manufacturer: MURATA; Part_type: CAPACITORS\CERAMIC; Mfr_part_number: GCM033C70J104KE02D; Mistral Part No: 120018100001-R; Custom_Duty: 15%; Customs_HS_Code: 85322990; Wattage: NA; Project: TI_J7_SVB-DUT; Value: 0.1uF; Footprint Path: Y:\MIS_DATABASE\Library\ALTIUM_TOOL\PCB_FOOTPRINTS\Altium_Footprint_Lib.PcbLib; Library Path: Y:\MIS_DATABASE\Library\ALTIUM_TOOL\SCHEMATICS_PARTS\MS_DISCRETE_Library.schlib; MECHANICAL 3D STEP FILE: CAP0201_0-5; Chkd/date: MANIRAJA/011018; Crtd /date: MANIRAJA/011018; Datasheet: Y:\MIS_DATABASE\DATASHEETS\CAPACITORS\MURATA-GCM-SER.PDF; Temperature: -55°C+125°C; Weight: NA; Height: 0.33MM; Library Ref: CAP; Distributor_part_number: NA; Distributor_name: NA; Tolerance: 10%; Mfr_name: MURATA; Footprint Ref: CAP0201_0-5; PCB Footprint: CAP0201_0-5
C465 = CAP_Dup1: CAP CERAMIC 0.1uF 6.3V 10% X7S AUTO 0201; Part Reference: C465; Mistral Part No: 120018100001-R; Mfr_name: MURATA; Mfr_part_number: GCM033C70J104KE02D; Part_type: CAPACITORS\CERAMIC; Project: TI_J7_SVB-DUT; Wattage: NA; Customs_HS_Code: 85322990; Custom_Duty: 15%; Value: 0.1uF; PCB Footprint: CAP0201_0-5; Footprint Ref: CAP0201_0-5; Tolerance: 10%; Distributor_name: NA; Distributor_part_number: NA; Library Ref: CAP; Height: 0.33MM; Weight: NA; Temperature: -55°C+125°C; Datasheet: Y:\MIS_DATABASE\DATASHEETS\CAPACITORS\MURATA-GCM-SER.PDF; Crtd /date: MANIRAJA/011018; Chkd/date: MANIRAJA/011018; MECHANICAL 3D STEP FILE: CAP0201_0-5; Library Path: Y:\MIS_DATABASE\Library\ALTIUM_TOOL\SCHEMATICS_PARTS\MS_DISCRETE_Library.schlib; Footprint Path: Y:\MIS_DATABASE\Library\ALTIUM_TOOL\PCB_FOOTPRINTS\Altium_Footprint_Lib.PcbLib; Manufacturer: MURATA
C466 = CAP_Dup1: CAP CERAMIC 0.1uF 6.3V 10% X7S AUTO 0201; Part Reference: C466; Manufacturer: MURATA; Part_type: CAPACITORS\CERAMIC; Mfr_part_number: GCM033C70J104KE02D; Mistral Part No: 120018100001-R; Custom_Duty: 15%; Customs_HS_Code: 85322990; Wattage: NA; Project: TI_J7_SVB-DUT; Value: 0.1uF; Footprint Path: Y:\MIS_DATABASE\Library\ALTIUM_TOOL\PCB_FOOTPRINTS\Altium_Footprint_Lib.PcbLib; Library Path: Y:\MIS_DATABASE\Library\ALTIUM_TOOL\SCHEMATICS_PARTS\MS_DISCRETE_Library.schlib; MECHANICAL 3D STEP FILE: CAP0201_0-5; Chkd/date: MANIRAJA/011018; Crtd /date: MANIRAJA/011018; Datasheet: Y:\MIS_DATABASE\DATASHEETS\CAPACITORS\MURATA-GCM-SER.PDF; Temperature: -55°C+125°C; Weight: NA; Height: 0.33MM; Library Ref: CAP; Distributor_part_number: NA; Distributor_name: NA; Tolerance: 10%; Mfr_name: MURATA; Footprint Ref: CAP0201_0-5; PCB Footprint: CAP0201_0-5
C468 = CAP_Dup1: CAP CERAMIC 0.1uF 6.3V 10% X7S AUTO 0201; Part Reference: C468; Mistral Part No: 120018100001-R; Mfr_name: MURATA; Mfr_part_number: GCM033C70J104KE02D; Part_type: CAPACITORS\CERAMIC; Project: TI_J7_SVB-DUT; Wattage: NA; Customs_HS_Code: 85322990; Custom_Duty: 15%; Value: 0.1uF; PCB Footprint: CAP0201_0-5; Footprint Ref: CAP0201_0-5; Tolerance: 10%; Distributor_name: NA; Distributor_part_number: NA; Library Ref: CAP; Height: 0.33MM; Weight: NA; Temperature: -55°C+125°C; Datasheet: Y:\MIS_DATABASE\DATASHEETS\CAPACITORS\MURATA-GCM-SER.PDF; Crtd /date: MANIRAJA/011018; Chkd/date: MANIRAJA/011018; MECHANICAL 3D STEP FILE: CAP0201_0-5; Library Path: Y:\MIS_DATABASE\Library\ALTIUM_TOOL\SCHEMATICS_PARTS\MS_DISCRETE_Library.schlib; Footprint Path: Y:\MIS_DATABASE\Library\ALTIUM_TOOL\PCB_FOOTPRINTS\Altium_Footprint_Lib.PcbLib; Manufacturer: MURATA
C469 = CAP_Dup1: CAP CERAMIC 0.1uF 6.3V 10% X7S AUTO 0201; Part Reference: C469; Mistral Part No: 120018100001-R; Mfr_name: MURATA; Mfr_part_number: GCM033C70J104KE02D; Part_type: CAPACITORS\CERAMIC; Project: TI_J7_SVB-DUT; Wattage: NA; Customs_HS_Code: 85322990; Custom_Duty: 15%; Value: 0.1uF; PCB Footprint: CAP0201_0-5; Footprint Ref: CAP0201_0-5; Tolerance: 10%; Distributor_name: NA; Distributor_part_number: NA; Library Ref: CAP; Height: 0.33MM; Weight: NA; Temperature: -55°C+125°C; Datasheet: Y:\MIS_DATABASE\DATASHEETS\CAPACITORS\MURATA-GCM-SER.PDF; Crtd /date: MANIRAJA/011018; Chkd/date: MANIRAJA/011018; MECHANICAL 3D STEP FILE: CAP0201_0-5; Library Path: Y:\MIS_DATABASE\Library\ALTIUM_TOOL\SCHEMATICS_PARTS\MS_DISCRETE_Library.schlib; Footprint Path: Y:\MIS_DATABASE\Library\ALTIUM_TOOL\PCB_FOOTPRINTS\Altium_Footprint_Lib.PcbLib; Manufacturer: MURATA
C470 = CAP_Dup1: CAP CERAMIC 0.1uF 6.3V 10% X7S AUTO 0201; Part Reference: C470; Mistral Part No: 120018100001-R; Mfr_name: MURATA; Mfr_part_number: GCM033C70J104KE02D; Part_type: CAPACITORS\CERAMIC; Project: TI_J7_SVB-DUT; Wattage: NA; Customs_HS_Code: 85322990; Custom_Duty: 15%; Value: 0.1uF; PCB Footprint: CAP0201_0-5; Footprint Ref: CAP0201_0-5; Tolerance: 10%; Distributor_name: NA; Distributor_part_number: NA; Library Ref: CAP; Height: 0.33MM; Weight: NA; Temperature: -55°C+125°C; Datasheet: Y:\MIS_DATABASE\DATASHEETS\CAPACITORS\MURATA-GCM-SER.PDF; Crtd /date: MANIRAJA/011018; Chkd/date: MANIRAJA/011018; MECHANICAL 3D STEP FILE: CAP0201_0-5; Library Path: Y:\MIS_DATABASE\Library\ALTIUM_TOOL\SCHEMATICS_PARTS\MS_DISCRETE_Library.schlib; Footprint Path: Y:\MIS_DATABASE\Library\ALTIUM_TOOL\PCB_FOOTPRINTS\Altium_Footprint_Lib.PcbLib; Manufacturer: MURATA
C471 = CAP_Dup1: CAP CERAMIC 0.1uF 6.3V 10% X7S AUTO 0201; Part Reference: C471; Mistral Part No: 120018100001-R; Mfr_name: MURATA; Mfr_part_number: GCM033C70J104KE02D; Part_type: CAPACITORS\CERAMIC; Project: TI_J7_SVB-DUT; Wattage: NA; Customs_HS_Code: 85322990; Custom_Duty: 15%; Value: 0.1uF; PCB Footprint: CAP0201_0-5; Footprint Ref: CAP0201_0-5; Tolerance: 10%; Distributor_name: NA; Distributor_part_number: NA; Library Ref: CAP; Height: 0.33MM; Weight: NA; Temperature: -55°C+125°C; Datasheet: Y:\MIS_DATABASE\DATASHEETS\CAPACITORS\MURATA-GCM-SER.PDF; Crtd /date: MANIRAJA/011018; Chkd/date: MANIRAJA/011018; MECHANICAL 3D STEP FILE: CAP0201_0-5; Library Path: Y:\MIS_DATABASE\Library\ALTIUM_TOOL\SCHEMATICS_PARTS\MS_DISCRETE_Library.schlib; Footprint Path: Y:\MIS_DATABASE\Library\ALTIUM_TOOL\PCB_FOOTPRINTS\Altium_Footprint_Lib.PcbLib; Manufacturer: MURATA
C472 = CAP_Dup1: CAP CERAMIC 0.1uF 6.3V 10% X7S AUTO 0201; Part Reference: C472; Part_type: CAPACITORS\CERAMIC; Mfr_part_number: GCM033C70J104KE02D; Mfr_name: MURATA; Mistral Part No: 120018100001-R; Custom_Duty: 15%; Customs_HS_Code: 85322990; Wattage: NA; Project: TI_J7_SVB-DUT; Value: 0.1uF; PCB Footprint: CAP0201_0-5; Footprint Path: Y:\MIS_DATABASE\Library\ALTIUM_TOOL\PCB_FOOTPRINTS\Altium_Footprint_Lib.PcbLib; Library Path: Y:\MIS_DATABASE\Library\ALTIUM_TOOL\SCHEMATICS_PARTS\MS_DISCRETE_Library.schlib; MECHANICAL 3D STEP FILE: CAP0201_0-5; Chkd/date: MANIRAJA/011018; Crtd /date: MANIRAJA/011018; Datasheet: Y:\MIS_DATABASE\DATASHEETS\CAPACITORS\MURATA-GCM-SER.PDF; Temperature: -55°C+125°C; Weight: NA; Height: 0.33MM; Library Ref: CAP; Distributor_part_number: NA; Distributor_name: NA; Tolerance: 10%; Footprint Ref: CAP0201_0-5; Manufacturer: MURATA
C473 = CAP_Dup1: CAP CERAMIC 0.1uF 6.3V 10% X7S AUTO 0201; Part Reference: C473; Mistral Part No: 120018100001-R; Mfr_name: MURATA; Mfr_part_number: GCM033C70J104KE02D; Part_type: CAPACITORS\CERAMIC; Project: TI_J7_SVB-DUT; Wattage: NA; Customs_HS_Code: 85322990; Custom_Duty: 15%; Value: 0.1uF; PCB Footprint: CAP0201_0-5; Footprint Ref: CAP0201_0-5; Tolerance: 10%; Distributor_name: NA; Distributor_part_number: NA; Library Ref: CAP; Height: 0.33MM; Weight: NA; Temperature: -55°C+125°C; Datasheet: Y:\MIS_DATABASE\DATASHEETS\CAPACITORS\MURATA-GCM-SER.PDF; Crtd /date: MANIRAJA/011018; Chkd/date: MANIRAJA/011018; MECHANICAL 3D STEP FILE: CAP0201_0-5; Library Path: Y:\MIS_DATABASE\Library\ALTIUM_TOOL\SCHEMATICS_PARTS\MS_DISCRETE_Library.schlib; Footprint Path: Y:\MIS_DATABASE\Library\ALTIUM_TOOL\PCB_FOOTPRINTS\Altium_Footprint_Lib.PcbLib; Manufacturer: MURATA
C474 = CAP_Dup1: CAP CERAMIC 0.1uF 6.3V 10% X7S AUTO 0201; Part Reference: C474; Part_type: CAPACITORS\CERAMIC; Mfr_part_number: GCM033C70J104KE02D; Mfr_name: MURATA; Mistral Part No: 120018100001-R; Custom_Duty: 15%; Customs_HS_Code: 85322990; Wattage: NA; Project: TI_J7_SVB-DUT; Value: 0.1uF; PCB Footprint: CAP0201_0-5; Footprint Path: Y:\MIS_DATABASE\Library\ALTIUM_TOOL\PCB_FOOTPRINTS\Altium_Footprint_Lib.PcbLib; Library Path: Y:\MIS_DATABASE\Library\ALTIUM_TOOL\SCHEMATICS_PARTS\MS_DISCRETE_Library.schlib; MECHANICAL 3D STEP FILE: CAP0201_0-5; Chkd/date: MANIRAJA/011018; Crtd /date: MANIRAJA/011018; Datasheet: Y:\MIS_DATABASE\DATASHEETS\CAPACITORS\MURATA-GCM-SER.PDF; Temperature: -55°C+125°C; Weight: NA; Height: 0.33MM; Library Ref: CAP; Distributor_part_number: NA; Distributor_name: NA; Tolerance: 10%; Footprint Ref: CAP0201_0-5; Manufacturer: MURATA